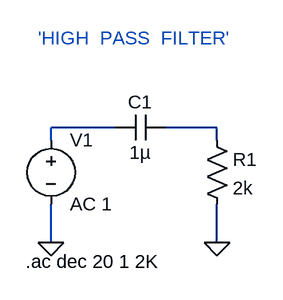
[diagram p0: schematic 2.Highpass filter.asc]
2.Highpass filter.asc, the LTspice schematic file:
Version 4
SHEET 1 880 680
WIRE 160 48 80 48
WIRE 288 48 224 48
WIRE 80 64 80 48
WIRE 288 64 288 48
WIRE 80 192 80 144
WIRE 288 192 288 144
FLAG 80 192 0
FLAG 288 192 0
SYMBOL cap 224 32 R90
WINDOW 0 0 32 VBottom 2
WINDOW 3 32 32 VTop 2
SYMATTR InstName C1
SYMATTR Value 1µ
SYMBOL res 272 48 R0
SYMATTR InstName R1
SYMATTR Value 2k
SYMBOL voltage 80 48 R0
SYMATTR InstName V1
SYMATTR Value AC 1
TEXT 64 -64 Left 2 ;'HIGH  PASS  FILTER'
TEXT 48 216 Left 2 !.ac dec 20 1 2K

The netlist it stands for:
* 2.Highpass filter.asc
C1 N002 N001 1µ
R1 N002 0 2k
V1 N001 0 AC 1
* 'HIGH  PASS  FILTER'
.ac dec 20 1 2K
.backanno
.end